# EAGLE design buck module 12v (EAGLE 9.5.2)
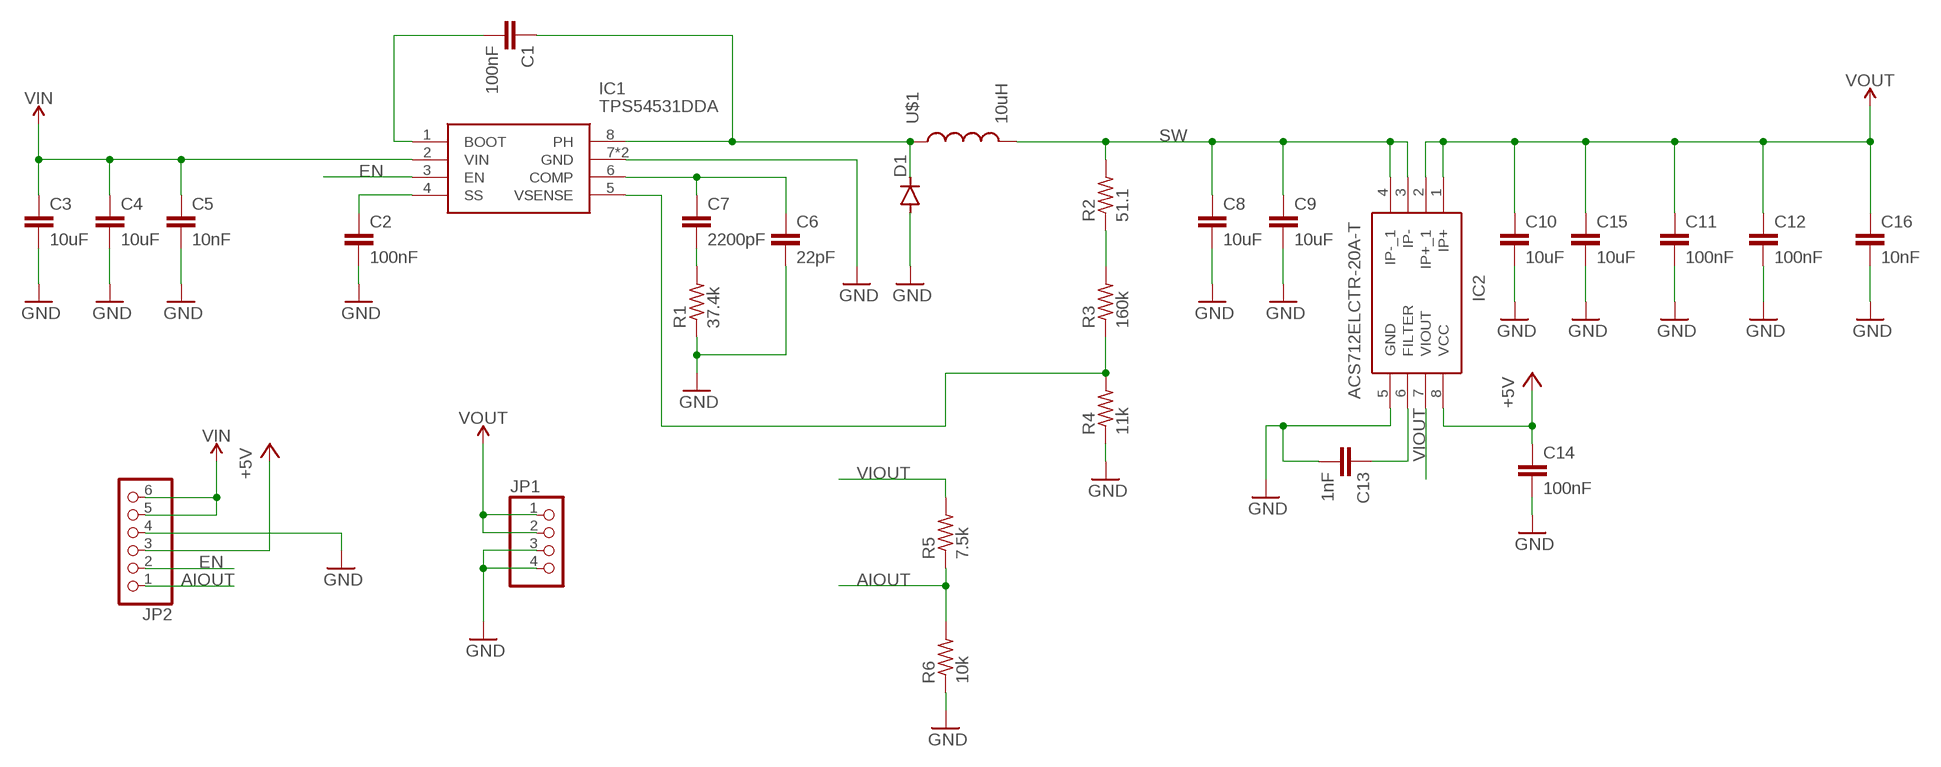
[diagram p0: schematic, sheet 1]

## Parts
C1  100nF  C-EUC0603  [C0603]
C2  100nF  C-EUC0603  [C0603]
C3  10uF  C-EUC1206  [C1206]
C4  10uF  C-EUC1206  [C1206]
C5  10nF  C-EUC0603  [C0603]
C6  22pF  C-EUC0603  [C0603]
C7  2200pF  C-EUC0603  [C0603]
C8  10uF  C-EUC1206  [C1206]
C9  10uF  C-EUC1206  [C1206]
C10  10uF  C-EUC1206  [C1206]
C11  100nF  C-EUC0603  [C0603]
C12  100nF  C-EUC0603  [C0603]
C13  1nF  C-EUC0603  [C0603]
C14  100nF  C-EUC0603  [C0603]
C15  10uF  C-EUC1206  [C1206]
C16  10nF  C-EUC0603  [C0603]
D1  DIODE-DO214AA  [DO214AA]
IC1  TPS54531DDA  [SOIC127P600X170-9N]
IC2  ACS712ELCTR-20A-T  [SOIC127P600X175-8N]
JP1  PINHD-1X4  [1X04]
JP2  PINHD-1X6  [1X06]
R1  37.4k  R-US_R0603  [R0603]
R2  51.1  R-US_R0603  [R0603]
R3  160k  R-US_R0603  [R0603]
R4  11k  R-US_R0603  [R0603]
R5  7.5k  R-US_R0603  [R0603]
R6  10k  R-US_R0603  [R0603]
U$1  10uH  22UH-1040-5A  [22UH-1040-5A]

## Nets
+5V: C14.1 IC2.8(VCC) JP2.3
AIOUT: JP2.1 R5.1 R6.2
EN: IC1.3(EN) JP2.2
GND: C2.2 C3.2 C4.2 C5.2 C6.2 C8.2 C9.2 C10.2 C11.2 C12.2 C13.2 C14.2 C15.2 C16.2 D1.A IC1.7(GND) IC1.9(GND) IC2.5(GND) JP1.3 JP1.4 JP2.4 R1.1 R4.1 R6.1
N$1: C1.2 IC1.1(BOOT)
N$2: C1.1 D1.C IC1.8(PH) U$1.P$1
N$3: C7.2 R1.2
N$4: C2.1 IC1.4(SS)
N$5: C6.1 C7.1 IC1.6(COMP)
N$7: C13.1 IC2.6(FILTER)
N$9: R2.1 R3.2
N$11: IC1.5(VSENSE) R3.1 R4.2
SW: C8.1 C9.1 IC2.3(IP-) IC2.4(IP-_1) R2.2 U$1.P$2
VIN: C3.1 C4.1 C5.1 IC1.2(VIN) JP2.5 JP2.6
VIOUT: IC2.7(VIOUT) R5.2
VOUT: C10.1 C11.1 C12.1 C15.1 C16.1 IC2.1(IP+) IC2.2(IP+_1) JP1.1 JP1.2

## Library data of the parts
C1-C16 = rcl:C-EU: CAPACITOR, European symbol; SPICEPREFIX: C
D1 = diode:DIODE-: DIODE
IC1 = LCSC:TPS54531DDA: 3.5V to 28V Input, 5A, 570kHz Step-Down Converter with Eco-mode Source: Datasheet <http://www.ti.com/lit/gpn/tps54531>; DESCRIPTION: 3.5V to 28V Input, 5A, 570kHz Step-Down Converter with Eco-mode; HEIGHT: 1.7mm; MANUFACTURER_NAME: Texas Instruments; MANUFACTURER_PART_NUMBER: TPS54531DDA; MOUSER_PART_NUMBER: 595-TPS54531DDA; MOUSER_PRICE-STOCK: https://www.mouser.com/Search/Refine.aspx?Keyword=595-TPS54531DDA
IC2 = LCSC:ACS712ELCTR-20A-T: ACS712ELCTR-20A-T, Hall Effect Sensor 5V 8-Pin SOIC, SOIC N Source: Datasheet <http://docs-emea.rs-online.com/webdocs/0d88/0900766b80d885f5.pdf>; ALLIED_NUMBER: R1076682; ALLIED_PRICE-STOCK: http://www.alliedelec.com/allegro-microsystems-acs712elctr-20a-t/R1076682/; DESCRIPTION: ACS712ELCTR-20A-T, Hall Effect Sensor 5V 8-Pin SOIC, SOIC N; HEIGHT: 1.75mm; MANUFACTURER_NAME: Allegro Microsystems; MANUFACTURER_PART_NUMBER: ACS712ELCTR-20A-T; RS_PART_NUMBER: 6807135P; RS_PRICE-STOCK: http://uk.rs-online.com/web/p/products/6807135P
JP1 = pinhead:PINHD-1X4: PIN HEADER
JP2 = pinhead:PINHD-1X6: PIN HEADER
R1-R6 = rcl:R-US_: RESISTOR, American symbol; SPICEPREFIX: R
U$1 = LCSC:22UH-1040-5A

## Board
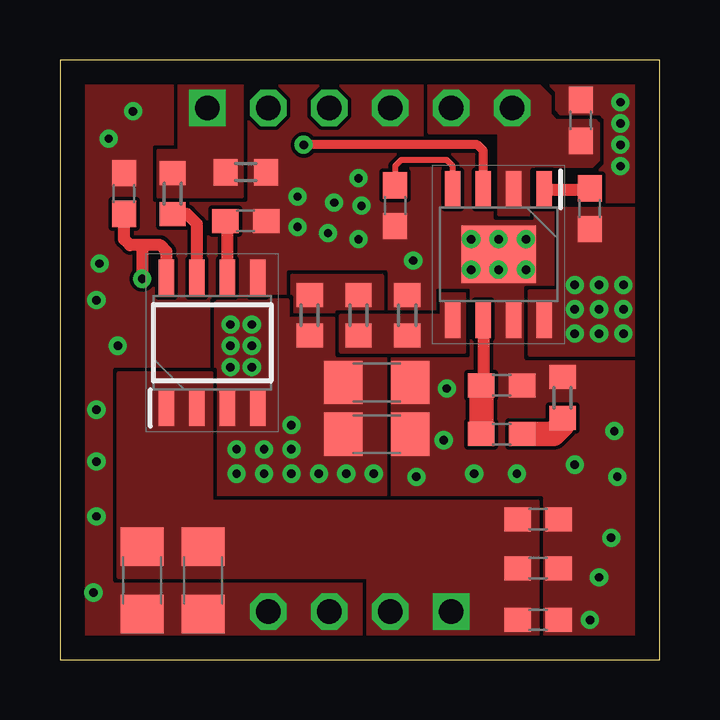
[diagram p1: board, top side]
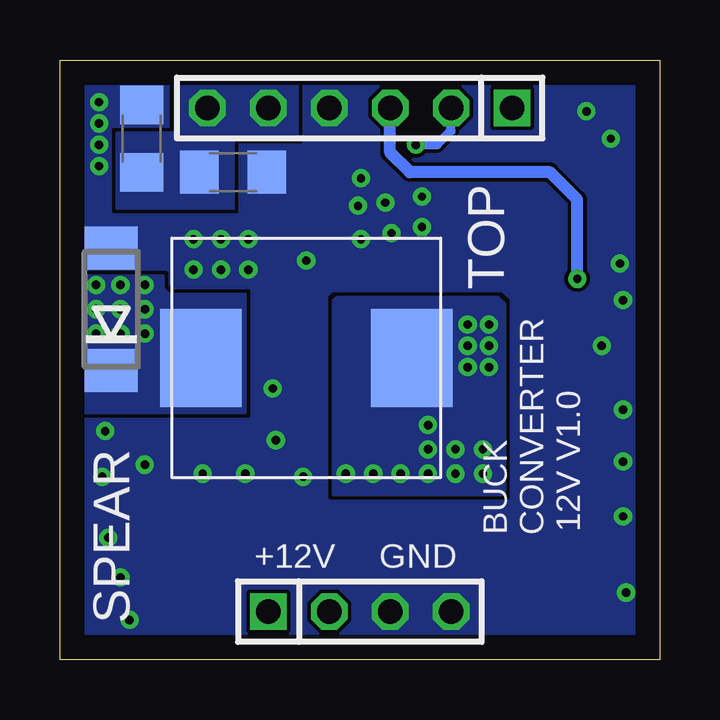
[diagram p2: board, bottom side, seen from below]

Size 25 x 25 mm. Coordinates in mm from the lower left corner, seen from the top.
Outline: 0,0 25,0 25,25 0,25 0,0
Copper layers (1*16): Top 0.035mm / dielectric 1.5mm / Bottom 0.035mm
Design rules "default *": minimum track width 6mil, minimum drill 0.35mm, track to track 6mil, track to pad 6mil, pad to pad 6mil, via to via 6mil, smd to smd 6mil, copper to edge 40mil, drill to drill 6mil, minimum pad ring 10mil, minimum via ring 8mil, stop-mask expansion 4mil, vias tented up to drill 15mil, thermal gap 10mil

### Footprints (pad centres in the part's own frame; a part is rotated, then mirrored left to right if it is on the bottom)
C0603 = smd 1.1 x 1: 1 -0.85,0; 2 0.85,0
C1206 = smd 1.6 x 1.8: 1 -1.4,0; 2 1.4,0
DO214AA = smd 1.8 x 2.2: A 2.55,0; C -2.55,0
SOIC127P600X170-9N = smd 1.525 x 0.65: 1 -2.712,1.905; 2 -2.712,0.635; 3 -2.712,-0.635; 4 -2.712,-1.905; 5 2.712,-1.905; 6 2.712,-0.635; 7 2.712,0.635; 8 2.712,1.905 | smd 2.4 x 3.1: 9 0,0
SOIC127P600X175-8N = smd 1.525 x 0.65: 1 -2.712,1.905; 2 -2.712,0.635; 3 -2.712,-0.635; 4 -2.712,-1.905; 5 2.712,-1.905; 6 2.712,-0.635; 7 2.712,0.635; 8 2.712,1.905
1X04 = drill 1.016 square: 1 -3.81,0 | drill 1.016 octagon: 2 -1.27,0; 3 1.27,0; 4 3.81,0
1X06 = drill 1.016 square: 1 -6.35,0 | drill 1.016 octagon: 2 -3.81,0; 3 -1.27,0; 4 1.27,0; 5 3.81,0; 6 6.35,0
R0603 = smd 1 x 1.1: 1 -0.85,0; 2 0.85,0
22UH-1040-5A = smd 3.4 x 4.1: P$1 -4.4,0; P$2 4.4,0

### Placement (x,y rotation side)
C1  22.1,18.8 90 top
C2  13.97,18.92 270 top
C3  21.59,21.72 90 bottom
C4  17.78,20.32 0 bottom
C5  21.72,22.48 90 top
C6  18.41,11.43 0 top
C7  18.41,9.4 0 top
C8  13.21,9.4 0 top
C9  13.21,11.56 0 top
C10  5.97,3.3 270 top
C11  19.94,3.81 0 top
C12  19.94,1.65 0 top
C13  7.75,18.29 0 top
C14  2.67,19.43 90 top
C15  3.43,3.3 270 top
C16  19.94,5.84 0 top
D1  22.86,14.61 90 bottom
IC1  18.29,16.89 270 top
IC2  6.35,13.21 90 top
JP1  12.5,2 0 bottom
JP2  12.5,23 180 bottom
R1  20.95,10.92 270 top
R2  10.41,14.35 270 top
R3  12.45,14.35 90 top
R4  14.48,14.35 270 top
R5  4.7,19.43 270 top
R6  7.75,20.32 180 top
U$1  14.73,12.57 0 bottom

### Tracks (layer width: path | path; a pad name or v marks a point on that pad's centre or on a via)
+5V  (via drill 0.35)
  Top 0.508: IC2.8 4.45,17.02 4.19,17.27 3.43,17.27 | C14.1 2.67,17.53 2.92,17.27 3.43,17.27 | 3.43,17.27 v3.43,15.88
  Bottom 0.508: v3.43,15.88 3.43,19.18 4.57,20.32 10.41,20.32 11.23,21.14 JP2.3
AIOUT
  pour Top (no thermals): 7.62,19.3 7.62,24.13 4.95,24.13 4.95,21.21 4.06,21.21 4.06,19.3
EN  (via drill 0.35)
  Top 0.381: IC1.3 17.65,21.21 17.4,21.46 v10.16,21.46
  Bottom 0.381: v10.16,21.46 9.27,21.46 8.69,22.04 JP2.2
GND  (via drill 0.35)
  other vias: 17.14,17.53 18.29,17.53 19.43,17.53 19.43,16.26 18.29,16.26 17.14,16.26 23.37,23.24 23.37,22.35 23.37,21.46 23.37,20.57 21.46,8.13 19.05,7.75 16,9.14 16.13,11.3 14.86,7.62 17.27,7.75 1.52,14.99 1.52,10.41 2.41,13.08 1.65,16.51 3.05,22.86 2.03,21.72 11.43,19.05 12.45,20.07 9.91,18.03 1.52,8.26 1.4,2.79 1.52,5.97 22.1,1.65 22.99,5.08 12.45,17.53 14.73,16.64 11.18,17.78 12.57,18.92 9.91,19.3 23.11,9.53 23.24,7.62 22.48,3.43
  pour Bottom (rank 6, no thermals): 0,25.27 0,-0.64 25.02,-0.64 25.02,25.27
  pour Top (rank 6, no thermals): -0.25,25.53 -0.25,-1.14 25.4,-1.14 25.4,25.53
N$1
  Top 0.508: IC1.1 22.05,19.6 C1.2
N$2  (via drill 0.35)
  other vias: 21.46,15.62 22.48,15.62 23.5,15.62 23.5,14.61 22.48,14.61 21.46,14.61 21.46,13.59 22.48,13.59 23.5,13.59
  pour Top (rank 2, no thermals): 19.56,14.86 19.56,12.7 24.38,12.7 24.38,18.16 24.38,18.8 20.83,18.8 20.83,15.37 19.56,15.37
  pour Bottom (rank 2, no thermals): 17.27,10.29 24.51,10.29 24.51,16 20.7,16 20.7,15.49 20.45,15.24 17.27,15.24
N$3
  Top 1.016: C7.2 20.57,9.4 20.95,9.78 R1.2
N$4
  Top 0.254: IC1.4 16.38,20.57 16.13,20.83 14.22,20.83 13.97,20.57 C2.1
N$5
  Top 0.508: IC1.6 17.65,11.52 C6.1
  Top 1.016: C7.1 C6.1
N$7
  Top 0.508: IC2.6 6.99,18.2 C13.1
N$9
  pour Top (rank 3, no thermals): 9.91,14.48 13.46,14.48 13.46,16 9.65,16 9.65,14.48
N$11
  pour Top (no thermals): 11.94,12.83 16.89,12.83 16.89,15.24 15.88,15.24 15.88,14.35 11.68,14.35 11.68,12.83
SW  (via drill 0.35)
  other vias: 7.37,8.76 8.51,8.76 9.65,9.78 8,12.19 7.37,7.75 8.51,7.75 9.65,7.75 10.79,7.75 11.94,7.75 13.08,7.75 9.65,8.76 7.11,12.19 7.11,13.08 8,13.08 8,13.97 7.11,13.97
  pour Bottom (rank 2, no thermals): 6.48,14.86 6.48,6.86 13.59,6.86 13.59,14.99 13.46,15.11 6.73,15.11
  pour Top (rank 2, no thermals): 6.48,6.86 13.59,6.86 13.59,12.7 11.43,12.7 11.43,14.22 9.53,14.22 9.53,14.99 6.6,14.99 6.48,14.86 6.48,14.73
VIN
  pour Bottom (rank 2, no thermals): 15.11,21.72 17.78,21.72 17.78,18.8 22.61,18.8 22.61,21.97 20.19,21.97 20.19,24.26 15.11,24.26
  pour Top (rank 2, no thermals): 15.37,21.97 18.16,21.97 18.29,21.97 18.29,18.54 19.56,18.54 19.56,20.45 19.68,20.57 22.23,20.57 22.48,20.83 22.48,21.84 22.48,22.35 22.35,22.48 20.7,22.48 20.45,22.73 20.45,23.5 19.81,24.13 15.37,24.13
VIOUT
  Top 0.508: IC2.7 5.71,18.16 5.29,18.58 R5.2
VOUT
  pour Top (no thermals): 2.41,3.43 12.83,3.43 12.83,0.64 19.94,0.64 19.94,6.6 6.35,6.6 6.35,11.94 2.41,11.94

### Text on the board
bPlace: TOP | SPEAR | 12V V1.0 | BUCK / CONVERTER | GND | +12V